# EAGLE design MDCC_1024k (EAGLE 6.3)
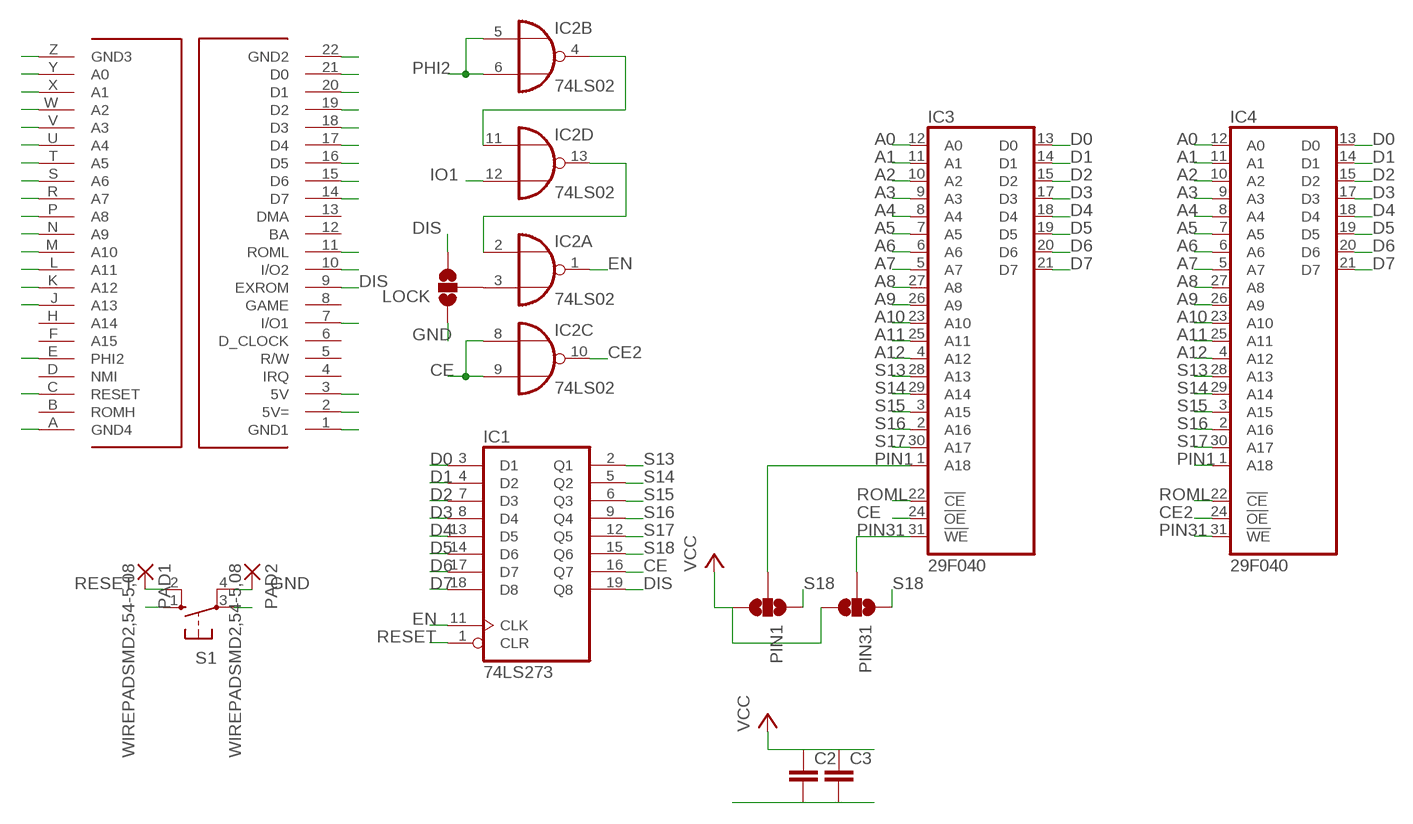
[diagram p0: schematic, sheet 1]

## Parts
C2  C-EU025-024X044  [C025-024X044]
C3  C-EU025-024X044  [C025-024X044]
IC1  74LS273  74HCT273N  [DIL20]
IC2  74LS02  74LS02N  [DIL14]
IC3  29F040  AM29F040N  [DIL32-6]
IC4  29F040  AM29F040N  [DIL32-6]
LOCK  SOLDERJUMPER_2WAYS  [SJ_3]
PAD1  WIREPADSMD2,54-5,08  [SMD2,54-5,08]
PAD2  WIREPADSMD2,54-5,08  [SMD2,54-5,08]
PIN1  SOLDERJUMPER_2WAYS  [SJ_3]
PIN31  SOLDERJUMPER_2WAYS  [SJ_3]
S1  10-XX  [B3F-10XX]
U$1  C64_EXPANSION__CARTRIDGE  [C64_EXPANSION__CARTRIDGE]

## Nets
A0: IC3.12(A0) IC4.12(A0) U$1.Y(A0)
A1: IC3.11(A1) IC4.11(A1) U$1.X(A1)
A2: IC3.10(A2) IC4.10(A2) U$1.W(A2)
A3: IC3.9(A3) IC4.9(A3) U$1.V(A3)
A4: IC3.8(A4) IC4.8(A4) U$1.U(A4)
A5: IC3.7(A5) IC4.7(A5) U$1.T(A5)
A6: IC3.6(A6) IC4.6(A6) U$1.S(A6)
A7: IC3.5(A7) IC4.5(A7) U$1.R(A7)
A8: IC3.27(A8) IC4.27(A8) U$1.P(A8)
A9: IC3.26(A9) IC4.26(A9) U$1.N(A9)
A10: IC3.23(A10) IC4.23(A10) U$1.M(A10)
A11: IC3.25(A11) IC4.25(A11) U$1.L(A11)
A12: IC3.4(A12) IC4.4(A12) U$1.K(A12)
A13: U$1.J(A13)
CE: IC1.16(Q7) IC2.8(C:I0) IC2.9(C:I1) IC3.24(!OE)
CE2: IC2.10(C:O) IC4.24(!OE)
D0: IC1.3(D1) IC3.13(D0) IC4.13(D0) U$1.21(D0)
D1: IC1.4(D2) IC3.14(D1) IC4.14(D1) U$1.20(D1)
D2: IC1.7(D3) IC3.15(D2) IC4.15(D2) U$1.19(D2)
D3: IC1.8(D4) IC3.17(D3) IC4.17(D3) U$1.18(D3)
D4: IC1.13(D5) IC3.18(D4) IC4.18(D4) U$1.17(D4)
D5: IC1.14(D6) IC3.19(D5) IC4.19(D5) U$1.16(D5)
D6: IC1.17(D7) IC3.20(D6) IC4.20(D6) U$1.15(D6)
D7: IC1.18(D8) IC3.21(D7) IC4.21(D7) U$1.14(D7)
DIS: IC1.19(Q8) LOCK.3 U$1.9(EXROM)
EN: IC1.11(CLK) IC2.1(A:O)
GND: C2.2 C3.2 LOCK.1 PAD2.1(P) S1.3(P) S1.4(P1) U$1.1(GND1) U$1.22(GND2) U$1.A(GND4) U$1.Z(GND3)
IO1: IC2.12(D:I1) U$1.7(I/O1)
IO2: U$1.10(I/O2)
N$3: IC2.3(A:I1) LOCK.2
N$7: IC2.4(B:O) IC2.11(D:I0)
N$9: IC2.2(A:I0) IC2.13(D:O)
PHI2: IC2.5(B:I0) IC2.6(B:I1) U$1.E(PHI2)
PIN1: IC3.1(A18) IC4.1(A18) PIN1.2
PIN31: IC3.31(!WE) IC4.31(!WE) PIN31.2
RESET: IC1.1(CLR) PAD1.1(P) S1.1(S) S1.2(S1) U$1.C(RESET)
ROML: IC3.22(!CE) IC4.22(!CE) U$1.11(ROML)
S13: IC1.2(Q1) IC3.28(A13) IC4.28(A13)
S14: IC1.5(Q2) IC3.29(A14) IC4.29(A14)
S15: IC1.6(Q3) IC3.3(A15) IC4.3(A15)
S16: IC1.9(Q4) IC3.2(A16) IC4.2(A16)
S17: IC1.12(Q5) IC3.30(A17) IC4.30(A17)
S18: IC1.15(Q6) PIN1.1 PIN31.1
VCC: C2.1 C3.1 PIN1.3 PIN31.3 U$1.2(5V=) U$1.3(5V)
Unconnected: U$1.4(IRQ) U$1.5(R/W) U$1.6(D_CLOCK) U$1.8(GAME) U$1.12(BA) U$1.13(DMA) U$1.B(ROMH) U$1.D(NMI) U$1.F(A15) U$1.H(A14)

## Power pins joined to a net without a drawn wire
GND: IC1.10(GND) IC2.7(P:GND) IC3.16(GND) IC4.16(GND)
VCC: IC1.20(VCC) IC2.14(P:VCC) IC3.32(VCC) IC4.32(VCC)

## Library data of the parts
C2 C3 = rcl:C-EU: CAPACITOR, European symbol
IC1 = 74xx-eu:74*273: Octal D type FLIP FLOP, clear
IC2 = 74xx-eu:74*02: Quad 2-input NOR gate
IC3 IC4 = 0RB_Memory:AM29F040: 4-Megabit FLASH MEMORY (512 K x 8 bit) 5 V-only
LOCK PIN1 PIN31 = SparkFun-Passives:SOLDERJUMPER_2WAY: Solder Jumper 2 way solder jumper
PAD1 PAD2 = wirepad:WIREPAD: Wire PAD connect wire on PCB
S1 = switch-omron:10-XX: OMRON SWITCH; MPN: B3F-1000; OC_FARNELL: 176432; OC_NEWARK: 36M3542
U$1 = 64kb_cart-twoboxes:C64_EXPANSION__CARTRIDGE

## Board
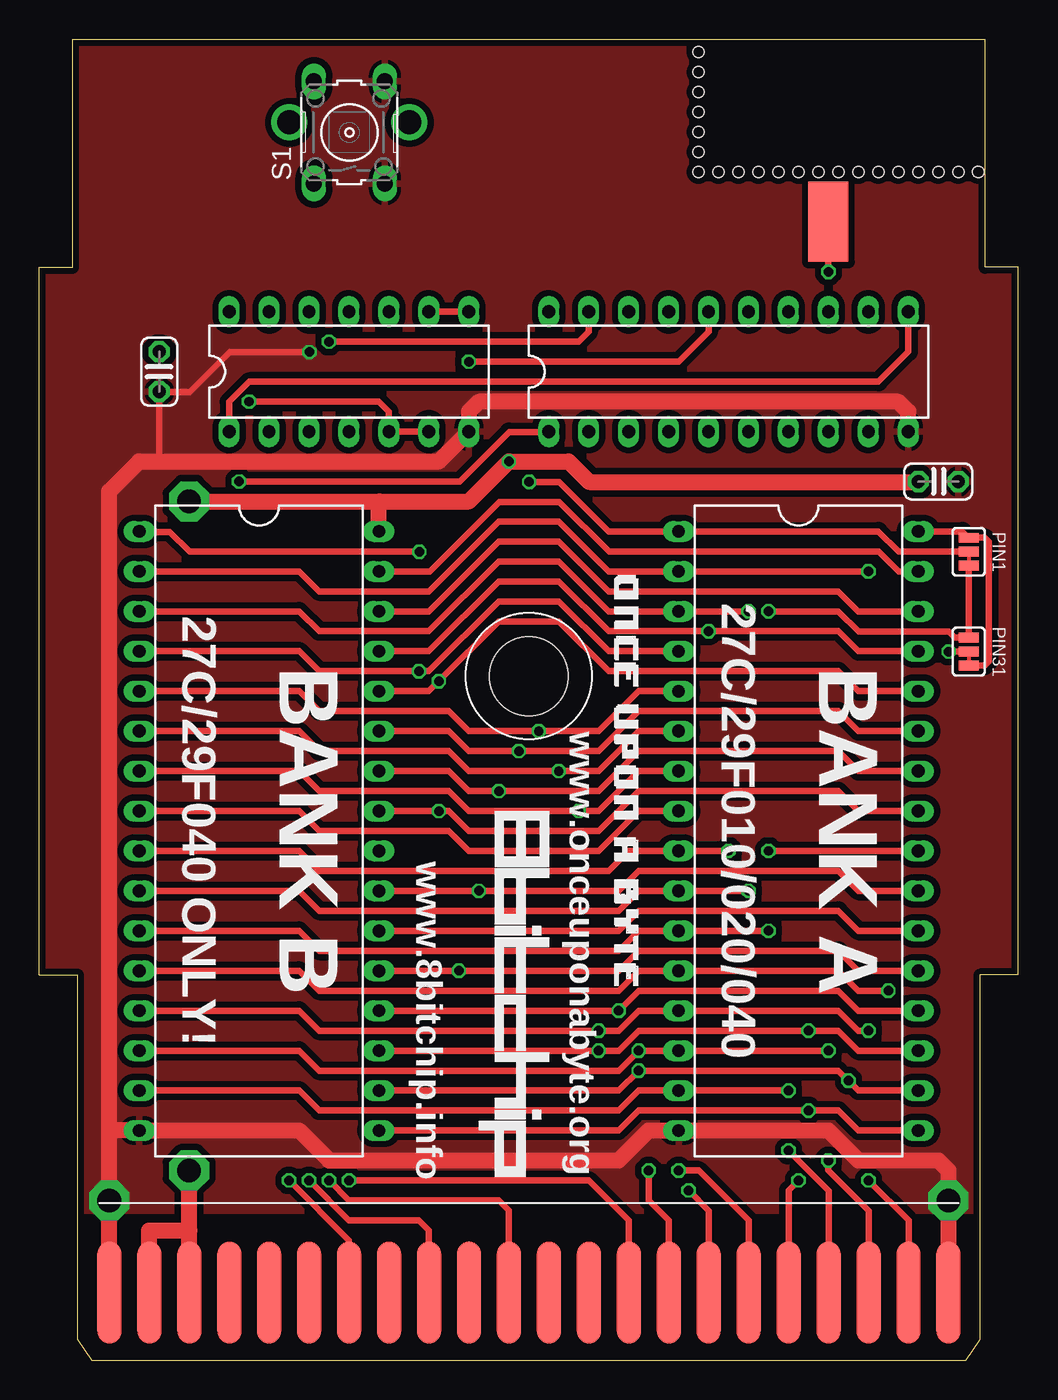
[diagram p1: board, top side]
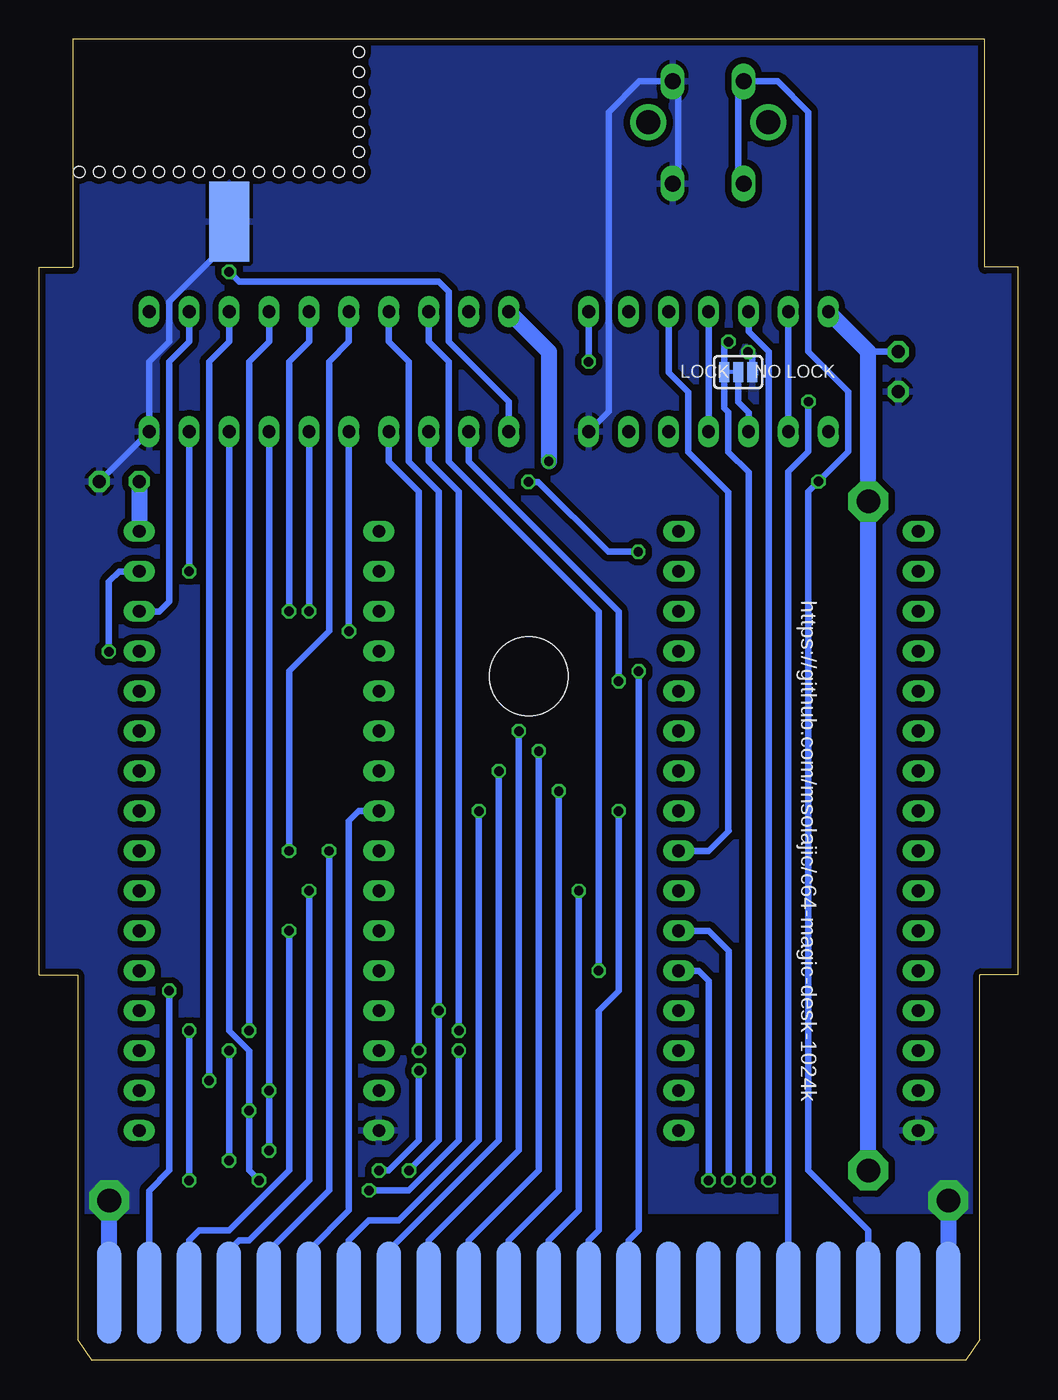
[diagram p2: board, bottom side, seen from below]

Size 62.23 x 84 mm. Coordinates in mm from the lower left corner, seen from the top.
Copper layers (1*16): Top 0.035mm / dielectric 1.5mm / Bottom 0.035mm
Design rules "elecrow_eagle_rule_v1.1 *": minimum track width 6mil, minimum drill 12mil, track to track 6mil, track to pad 6mil, pad to pad 6mil, via to via 6mil, smd to smd 0mil, copper to edge 10mil, drill to drill 10mil, minimum pad ring 10mil, minimum via ring 6mil, stop-mask expansion 2mil, vias tented up to drill 100mil, thermal gap 10mil
Holes 0.7 mm at 41.91,83.19 41.91,81.91 41.91,80.64 41.91,79.38 41.91,78.1 41.91,76.83 43.18,75.56 44.45,75.56 45.72,75.56 46.99,75.56 48.26,75.56 49.53,75.56 50.8,75.56 52.07,75.56 53.34,75.56 54.61,75.56 55.88,75.56 57.15,75.56 58.42,75.56 59.69,75.56 41.91,75.56

### Footprints (pad centres in the part's own frame; a part is rotated, then mirrored left to right if it is on the bottom)
C025-024X044 = drill 0.813 octagon: 1 -1.27,0; 2 1.27,0
DIL20 = drill 0.813 long: 1 -11.43,-3.81; 2 -8.89,-3.81; 3 -6.35,-3.81; 4 -3.81,-3.81; 5 -1.27,-3.81; 6 1.27,-3.81; 7 3.81,-3.81; 8 6.35,-3.81; 9 8.89,-3.81; 10 11.43,-3.81; 11 11.43,3.81; 12 8.89,3.81; 13 6.35,3.81; 14 3.81,3.81; 15 1.27,3.81; 16 -1.27,3.81; 17 -3.81,3.81; 18 -6.35,3.81; 19 -8.89,3.81; 20 -11.43,3.81
DIL14 = drill 0.813 long: 1 -7.62,-3.81; 2 -5.08,-3.81; 3 -2.54,-3.81; 4 0,-3.81; 5 2.54,-3.81; 6 5.08,-3.81; 7 7.62,-3.81; 8 7.62,3.81; 9 5.08,3.81; 10 2.54,3.81; 11 0,3.81; 12 -2.54,3.81; 13 -5.08,3.81; 14 -7.62,3.81
DIL32-6 = drill 0.813 long: 1 -19.05,-7.62; 2 -16.51,-7.62; 3 -13.97,-7.62; 4 -11.43,-7.62; 5 -8.89,-7.62; 6 -6.35,-7.62; 7 -3.81,-7.62; 8 -1.27,-7.62; 9 1.27,-7.62; 10 3.81,-7.62; 11 6.35,-7.62; 12 8.89,-7.62; 13 11.43,-7.62; 14 13.97,-7.62; 15 16.51,-7.62; 16 19.05,-7.62; 17 19.05,7.62; 18 16.51,7.62; 19 13.97,7.62; 20 11.43,7.62; 21 8.89,7.62; 22 6.35,7.62; 23 3.81,7.62; 24 1.27,7.62; 25 -1.27,7.62; 26 -3.81,7.62; 27 -6.35,7.62; 28 -8.89,7.62; 29 -11.43,7.62; 30 -13.97,7.62; 31 -16.51,7.62; 32 -19.05,7.62
SJ_3 = smd 0.635 x 1.27: 1 -0.889,0; 2 0,0; 3 0.889,0
SMD2,54-5,08 = smd 2.54 x 5.08: 1 0,0
B3F-10XX = drill 1.016 long: 1 -3.251,2.261; 2 3.251,2.261; 3 -3.251,-2.261; 4 3.251,-2.261
C64_EXPANSION__CARTRIDGE = smd 1.524 x 6.477: 1 5.09,4.31; 2 7.63,4.31; 3 10.17,4.31; 4 12.71,4.31; 5 15.25,4.31; 6 17.79,4.31; 7 20.33,4.31; 8 22.87,4.31; 9 25.41,4.31; 10 27.95,4.31; 11 30.49,4.31; 12 33.03,4.31; 13 35.57,4.31; 14 38.11,4.31; 15 40.65,4.31; 16 43.19,4.31; 17 45.73,4.31; 18 48.27,4.31; 19 50.81,4.31; 20 53.35,4.31; 21 55.89,4.31; 22 58.43,4.31 | smd 1.524 x 6.477 bottom: A 5.09,4.31; B 7.63,4.31; C 10.17,4.31; D 12.71,4.31; E 15.25,4.31; F 17.79,4.31; H 20.33,4.31; J 22.87,4.31; K 25.41,4.31; L 27.95,4.31; M 30.49,4.31; N 33.03,4.31; P 35.57,4.31; R 38.11,4.31; S 40.65,4.31; T 43.19,4.31; U 45.73,4.31; V 48.27,4.31; W 50.81,4.31; X 53.35,4.31; Y 55.89,4.31; Z 58.43,4.31 | hole 5: 31.75,43.5

### Placement (x,y rotation side)
C2  7.62,62.87 270 top
C3  57.15,55.88 0 top
IC1  43.81,62.87 0 top
IC2  19.68,62.87 0 top
IC3  48.26,33.66 270 top
IC4  13.97,33.66 270 top
LOCK  17.81,62.84 180 bottom
PAD1  50.16,72.39 0 top
PAD2  50.16,72.39 0 bottom
PIN1  59.08,51.41 90 top
PIN31  59.08,45.06 270 top
S1  19.71,78.08 90 top
U$1  -0.64,0 0 top

### Tracks (layer width: path | path; a pad name or v marks a point on that pad's centre or on a via)
A0  (via drill 0.6)
  Top 0.406: IC4.12 16.51,24.76 17.78,23.49 36.83,23.49 38.1,24.76 IC3.12 50.8,24.76 52.07,23.49 v53.98,23.49
  Bottom 0.406: U$1.Y 55.26,10.78 53.98,12.06 v53.98,23.49
A1  (via drill 0.6)
  Top 0.406: IC4.11 16.51,27.3 17.78,26.03 36.83,26.03 38.1,27.3 IC3.11 v46.36,27.3
  Bottom 0.406: v46.36,27.3 46.36,12.06 50.17,8.25 52.07,8.25 52.72,7.61 U$1.X
A2  (via drill 0.6)
  Top 0.406: IC4.10 16.51,29.84 17.78,28.57 36.83,28.57 38.1,29.84 IC3.10 v45.09,29.84
  Bottom 0.406: v45.09,29.84 45.09,11.43 48.9,7.62 49.53,7.62 50.18,6.97 U$1.W
A3  (via drill 0.6)
  Top 0.406: IC4.9 16.51,32.38 17.78,31.11 36.2,31.11 37.47,32.38 IC3.9 v43.82,32.38
  Bottom 0.406: U$1.V 47.63,6.98 43.82,10.79 v43.82,32.38
A4
  Top 0.406: IC4.8 16.51,34.92 17.78,33.65 26.04,33.65 27.31,32.38 35.56,32.38 38.1,34.92 IC3.8
  Bottom 0.406: U$1.U 45.09,6.98 42.55,9.52 42.55,34.29 41.91,34.92 IC3.8
A5  (via drill 0.6)
  Top 0.406: IC4.7 16.51,37.46 17.78,36.19 26.04,36.19 27.31,34.92 v34.29,34.92 35.56,34.92 38.1,37.46 IC3.7
  Bottom 0.406: U$1.T 42.55,7.62 41.28,8.89 39.37,8.89 34.29,13.97 v34.29,34.92
A6  (via drill 0.6)
  Top 0.406: IC4.6 16.51,40 17.78,38.73 26.04,38.73 27.31,37.46 v33.02,37.46 35.56,37.46 38.1,40 IC3.6
  Bottom 0.406: v33.02,37.46 33.02,13.97 40.01,6.98 U$1.S
A7  (via drill 0.6)
  Top 0.406: IC4.5 16.51,42.54 17.78,41.27 26.04,41.27 27.31,40 v31.75,40 35.56,40 38.1,42.54 IC3.5
  Bottom 0.406: v31.75,40 31.75,13.33 37.47,7.62 U$1.R
A8  (via drill 0.6)
  Top 0.406: IC4.27 26.04,40 27.31,38.73 v30.48,38.73 35.56,38.73 38.1,41.27 50.8,41.27 52.07,40 IC3.27
  Bottom 0.406: v30.48,38.73 30.48,12.06 34.93,7.62 U$1.P
A9  (via drill 0.6)
  Top 0.406: IC4.26 26.04,37.46 27.31,36.19 v29.21,36.19 35.56,36.19 38.1,38.73 50.8,38.73 52.07,37.46 IC3.26
  Bottom 0.406: U$1.N 32.39,7.62 29.21,10.79 v29.21,36.19
A10  (via drill 0.6)
  Top 0.406: IC4.23 v27.94,29.84 36.83,29.84 38.1,31.11 50.8,31.11 52.07,29.84 IC3.23
  Bottom 0.406: U$1.M 29.85,7.62 27.94,9.52 v27.94,29.84
A11  (via drill 0.6)
  Top 0.406: IC4.25 v25.4,34.92 26.04,34.92 27.31,33.65 35.56,33.65 38.1,36.19 50.8,36.19 52.07,34.92 IC3.25
  Bottom 0.406: v25.4,34.92 25.4,23.49 26.67,22.22 26.67,8.25 27.31,7.62 U$1.L
A12  (via drill 0.6)
  Top 0.406: IC4.4 16.51,45.08 17.78,43.81 v24.13,43.81 24.77,43.81 29.21,48.26 33.02,48.26 36.2,45.08 IC3.4
  Bottom 0.406: v24.13,43.81 24.13,8.25 24.77,7.62 U$1.K
CE  (via drill 0.6)
  Top 0.406: v46.36,32.38 IC3.24 | IC2.9 IC2.8 | IC1.16 42.55,65.4 40.64,63.5 v27.31,63.5
  Bottom 0.406: IC1.16 42.55,64.77 43.82,63.5 43.82,46.35 46.36,43.81 v46.36,32.38 | v27.31,63.5 IC2.8
CE2
  Bottom 0.406: IC4.24 19.69,32.38 18.42,33.65 18.44,33.68 18.44,55.22 20.98,57.76 20.98,61.57 22.23,62.81 IC2.10
D0  (via drill 0.6)
  Top 0.406: IC4.13 16.51,22.22 17.78,20.95 v35.56,20.95 36.83,20.95 38.1,22.22 IC3.13 50.8,22.22 52.07,20.95 v52.71,20.95 | U$1.21 55.26,8.88 v52.71,11.43
  Bottom 0.406: IC1.3 37.47,57.15 35.56,55.24 v35.56,20.95 | v52.71,11.43 v52.71,20.95
D1  (via drill 0.6)
  Top 0.406: IC4.14 16.51,19.68 17.78,18.41 36.83,18.41 v38.1,19.68 IC3.14 v50.17,19.68 | U$1.20 52.72,9.51 50.17,12.06 v50.17,12.7
  Bottom 0.406: IC1.4 40.01,57.15 38.1,55.24 v38.1,19.68 | v50.17,12.7 v50.17,19.68
D2  (via drill 0.6)
  Top 0.406: IC4.15 16.51,17.14 17.78,15.87 36.83,15.87 38.1,17.14 IC3.15 v47.63,17.14 | U$1.19 50.18,10.78 v47.63,13.33
  Bottom 0.406: IC1.7 v47.63,17.14 v47.63,13.33
D3  (via drill 0.6)
  Top 0.406: IC4.17 36.83,14.6 38.1,15.87 v48.9,15.87 50.8,15.87 52.07,14.6 IC3.17 | U$1.18 47.64,10.8 v48.26,11.43
  Bottom 0.406: IC1.8 50.17,20.95 48.9,19.68 v48.9,15.87 48.9,12.06 v48.26,11.43
D4  (via drill 0.6)
  Top 0.406: IC4.18 36.83,17.14 v38.1,18.41 50.8,18.41 v51.44,17.78 52.07,17.14 IC3.18 | U$1.17 45.1,8.88 41.91,12.06 v40.64,12.06
  Bottom 0.406: IC1.13 50.17,64.77 51.44,63.5 v51.44,17.78 | v38.1,18.41 38.1,13.97 40.01,12.06 v40.64,12.06
D5  (via drill 0.6)
  Top 0.406: IC4.19 v35.56,19.68 36.83,19.68 38.1,20.95 v48.9,20.95 50.8,20.95 52.07,19.68 IC3.19 | U$1.16 42.56,9.51 v41.28,10.79
  Bottom 0.406: IC1.14 47.63,64.77 48.9,63.5 v48.9,20.95 | v41.28,10.79 38.74,10.79 35.56,13.97 v35.56,19.68
D6  (via drill 0.6)
  Top 0.406: IC3.20 52.07,22.22 50.8,23.49 38.1,23.49 v36.83,22.22 IC4.20 | U$1.15 40.01,8.89 38.74,10.16 v38.74,12.06
  Bottom 0.406: IC1.17 40.01,64.77 38.74,63.5 38.74,57.15 36.83,55.24 v36.83,22.22 36.83,13.97 v38.74,12.06
D7  (via drill 0.6)
  Top 0.406: IC4.21 v26.67,24.76 36.83,24.76 38.1,26.03 50.8,26.03 52.07,24.76 IC3.21 | v19.69,11.43 34.93,11.43 37.47,8.89 U$1.14
  Bottom 0.406: IC1.18 37.47,64.77 36.2,63.5 36.2,57.15 26.67,47.62 v26.67,24.76 | v19.69,11.43 19.69,24.13 20.32,24.76 IC4.21
DIS  (via drill 0.6)
  Top 0.406: U$1.9 24.77,8.25 24.13,8.89 19.69,8.89 v17.15,11.43 | IC1.19 34.93,65.4 34.29,64.77 v18.42,64.77
  Bottom 0.406: v17.15,11.43 17.15,56.46 18.44,57.76 18.44,60.3 18.69,60.55 LOCK.3 18.69,64.49 v18.42,64.77
EN
  Top 0.406: IC1.11 55.25,64.13 53.34,62.23 13.34,62.23 12.07,60.96 IC2.1
GND  (via drill 0.6, 1.5 pad 2.54)
  Top 0.406: 7.62,57.15 C2.2 7.65,61.57 9.55,61.57 12.09,64.11 v17.17,64.11
  Top 1.016: U$1.A v4.45,10.16 4.45,14.6 | U$1.22 v57.79,10.16 57.79,12.06 57.15,12.7 52.07,12.7 50.17,14.6 IC3.16 38.74,14.6 36.83,12.7 18.42,12.7 16.51,14.6 IC4.16 4.45,14.6 | IC1.10 55.25,60.32 54.61,60.96 27.94,60.96 27.31,60.32 IC2.7 25.4,57.15 7.62,57.15 6.35,57.15 4.45,55.24 4.45,14.6
  Bottom 0.406: PAD2.1 50.17,71.12 53.98,67.31 53.98,64.77 55.25,63.5 IC1.10 C3.2 | IC2.7 26.04,60.32 26.04,79.37 24.08,81.33 S1.4 21.62,80.98 21.62,74.9 21.69,74.83 S1.3 | LOCK.1 16.92,63.86 v17.17,64.11
  Bottom 1.016: v4.45,10.16 U$1.A | U$1.22 57.8,10.15 v57.79,10.16
  pour Top (isolate 0.406): -0.61,85.7 64.8,85.7 64.8,9.5 -0.61,9.5
  pour Bottom (isolate 0.406): 66.07,86.97 -1.88,86.97 -1.88,9.5 66.07,9.5
IO1  (via drill 0.6)
  Top 0.406: U$1.7 19.69,7.62 v15.88,11.43
  Bottom 0.406: v15.88,11.43 15.88,64.13 17.15,65.4 IC2.12
N$1  (via drill 1.52)
  other vias: 15.9,78.71
N$2  (via drill 1.52)
  other vias: 23.52,78.71
N$3
  Bottom 0.254: LOCK.2 18.44,62.84
  Bottom 0.406: IC2.3 17.15,60.27 17.81,60.93 LOCK.2
N$7
  Bottom 0.406: IC2.4 IC2.11
N$9
  Bottom 0.406: IC2.13 IC2.2
PHI2  (via drill 0.6)
  Top 0.406: IC2.6 IC2.5 22.23,60.32 21.59,60.96 v13.34,60.96
  Bottom 0.406: U$1.E 14.61,54.61 14.61,56.51 13.34,57.78 v13.34,60.96
PIN1  (via drill 0.6)
  Top 0.254: PIN1.2 59.08,50.77
  Top 0.406: v31.14,55.85 33.05,55.85 36.2,52.7 IC3.1 53.34,52.7 54.64,51.41 PIN1.2 | v24.16,51.41 9.55,51.41 8.28,52.68 6.38,52.68 IC4.1
  Bottom 0.406: v31.14,55.85 30.51,55.85 26.06,51.41 v24.16,51.41
PIN31  (via drill 0.6)
  Top 0.254: PIN31.2 59.08,44.42
  Top 0.406: IC4.31 24.82,50.16 29.24,54.58 33.05,54.58 36.22,51.41 53.37,51.41 54.64,50.14 55.85,50.14 IC3.31 | v57.81,45.06 PIN31.2
  Bottom 0.406: IC3.31 57.15,50.16 57.81,49.5 v57.81,45.06
RESET  (via drill 0.6)
  Top 0.406: v12.7,55.88 26.72,55.88 29.87,59.03 32.36,59.03 IC1.1 | v50.17,69.21 PAD1.1
  Bottom 0.406: U$1.C 9.53,8.25 13.34,12.06 13.34,55.24 v12.7,55.88 10.8,57.78 10.8,61.59 13.34,64.13 13.34,79.37 15.29,81.33 S1.2 17.81,80.98 17.81,74.9 17.73,74.83 S1.1 | IC1.1 32.39,60.96 36.2,64.77 36.2,67.94 36.83,68.58 49.53,68.58 v50.17,69.21
ROML  (via drill 0.6)
  Top 0.406: IC4.22 36.83,27.3 38.1,28.57 50.8,28.57 52.07,27.3 IC3.22 | U$1.11 29.85,9.52 29.21,10.16 19.69,10.16 v18.42,11.43
  Bottom 0.406: v18.42,11.43 18.42,26.03 19.69,27.3 IC4.22
S13  (via drill 0.6)
  Top 0.406: IC4.28 24.77,42.54 v25.4,43.18 29.21,46.99 33.02,46.99 36.2,43.81 50.8,43.81 52.07,42.54 IC3.28
  Bottom 0.406: IC1.2 34.93,57.15 25.4,47.62 v25.4,43.18
S14  (via drill 0.6)
  Top 0.406: IC4.29 24.77,45.08 29.21,49.53 33.02,49.53 36.2,46.35 v42.55,46.35 50.8,46.35 52.07,45.08 IC3.29
  Bottom 0.406: IC1.5 v42.55,46.35
S15  (via drill 0.6)
  Top 0.406: IC4.3 16.51,47.62 17.78,46.35 24.77,46.35 29.21,50.8 33.02,50.8 36.2,47.62 IC3.3 v45.09,47.62
  Bottom 0.406: IC1.6 v45.09,47.62
S16  (via drill 0.6)
  Top 0.406: IC4.2 16.51,50.16 17.78,48.89 24.77,48.89 29.21,53.34 33.02,53.34 36.2,50.16 IC3.2 v52.71,50.16
  Bottom 0.406: IC1.9 v52.71,50.16
S17
  Top 0.406: IC4.30 24.77,47.62 29.21,52.07 33.02,52.07 36.2,48.89 50.8,48.89 52.07,47.62 IC3.30
  Bottom 0.406: IC1.12 52.71,64.77 53.98,63.5 53.98,48.26 54.61,47.62 IC3.30
S18  (via drill 0.6)
  Top 0.406: v46.36,47.62 50.8,47.62 52.1,46.33 57.81,46.33 58.19,45.95 PIN31.1 PIN1.1
  Bottom 0.406: IC1.15 45.09,64.77 46.36,63.5 v46.36,47.62
VCC  (via drill 0.6, 1.5 pad 2.54)
  Top 0.406: IC3.32 58.67,52.7 PIN1.3 60.1,52.3 60.35,52.04 60.35,44.42 60.1,44.17 PIN31.3
  Top 1.016: U$1.3 9.54,8.25 | U$1.2 7,8.24 6.99,8.25 9.54,8.25 | 9.54,8.25 9.54,12.05 v9.53,12.06 | v9.53,54.61 21.62,54.61 | 21.62,54.61 27.31,54.61 v29.85,57.15 33.66,57.15 34.95,55.85 55.85,55.85 C3.1 | IC4.32 21.59,54.58 21.62,54.61
  Bottom 0.406: C2.1 9.53,64.13
  Bottom 1.016: v9.53,12.06 v9.53,54.61 9.53,64.13 IC2.14 | IC1.20 29.85,64.13 v29.85,57.15 | C3.1 IC3.32

### Text on the board
tNames: 27C/29F040 ONLY! | BANK B | 27C/29F010/020/040 | BANK A | www.onceuponabyte.org | www.8bitchip.info
bNames: LOCK NO LOCK | https://github.com/msolajic/c64-magic-desk-1024k
tStop: COMPATIBLE CARTRIDGE